# EAGLE schematic Arduino lcd (EAGLE 9.6.2)
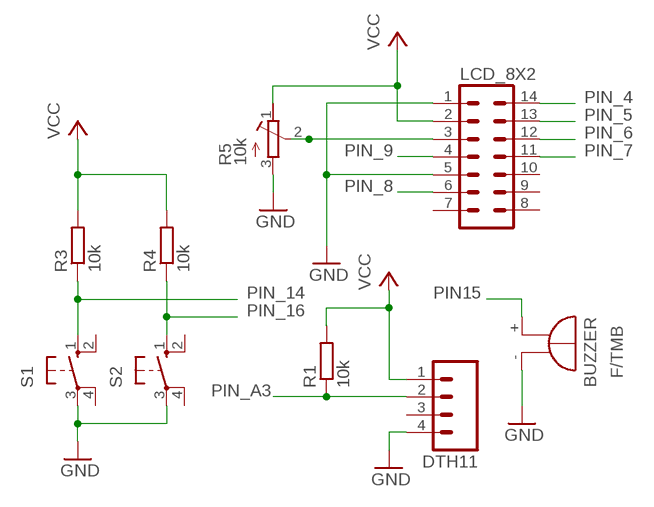
[diagram p0: schematic, sheet 1]

## Parts
BUZZER  F/TMB  [F/TMB]
DTH11  M04  [04P]
LCD_8X2  IC14P  [IC14P]
R1  10k  R-EU_0207/10  [0207/10]
R3  10k  R-EU_0207/10  [0207/10]
R4  10k  R-EU_0207/10  [0207/10]
R5  10k  R-TRIMM3314J  [RTRIM3314J]
S1  10-XX  [B3F-10XX]
S2  10-XX  [B3F-10XX]

## Nets
GND: BUZZER.- DTH11.4 LCD_8X2.1 LCD_8X2.5 R5.3(A) S1.3(P) S2.3(P)
N$1: LCD_8X2.3 R5.2(S)
PIN15: BUZZER.+
PIN_4: LCD_8X2.14
PIN_5: LCD_8X2.13
PIN_6: LCD_8X2.12
PIN_7: LCD_8X2.11
PIN_8: LCD_8X2.6
PIN_9: LCD_8X2.4
PIN_14: R3.1 S1.1(S)
PIN_16: R4.1 S2.1(S)
PIN_A3: DTH11.2 R1.1
VCC: DTH11.1 LCD_8X2.2 R1.2 R3.2 R4.2 R5.1(E)
Unconnected: DTH11.3 LCD_8X2.7 LCD_8X2.8 LCD_8X2.9 LCD_8X2.10 S1.2(S1) S1.4(P1) S2.2(S1) S2.4(P1)

## Library data of the parts
BUZZER = buzzer:F/TMB: BUZZER Source: Buerklin; OC_FARNELL: unknown; OC_NEWARK: unknown
DTH11 = con-amp-quick:M04: AMP QUICK CONNECTOR; OC_FARNELL: unknown; OC_NEWARK: unknown
LCD_8X2 = con-dil:IC14P: DIL CABLE CONNECTOR
R1 R3 R4 = rcl:R-EU_: RESISTOR, European symbol; SPICEPREFIX: R
R5 = rcl:R-TRIMM: Trimm resistor; SPICEMODEL: X; SPICEPREFIXL: POT
S1 S2 = switch-omron:10-XX: OMRON SWITCH; MPN: B3F-1000; OC_FARNELL: 176432; OC_NEWARK: 36M3542